# Altium project EMI_TestBoard.PrjPcb
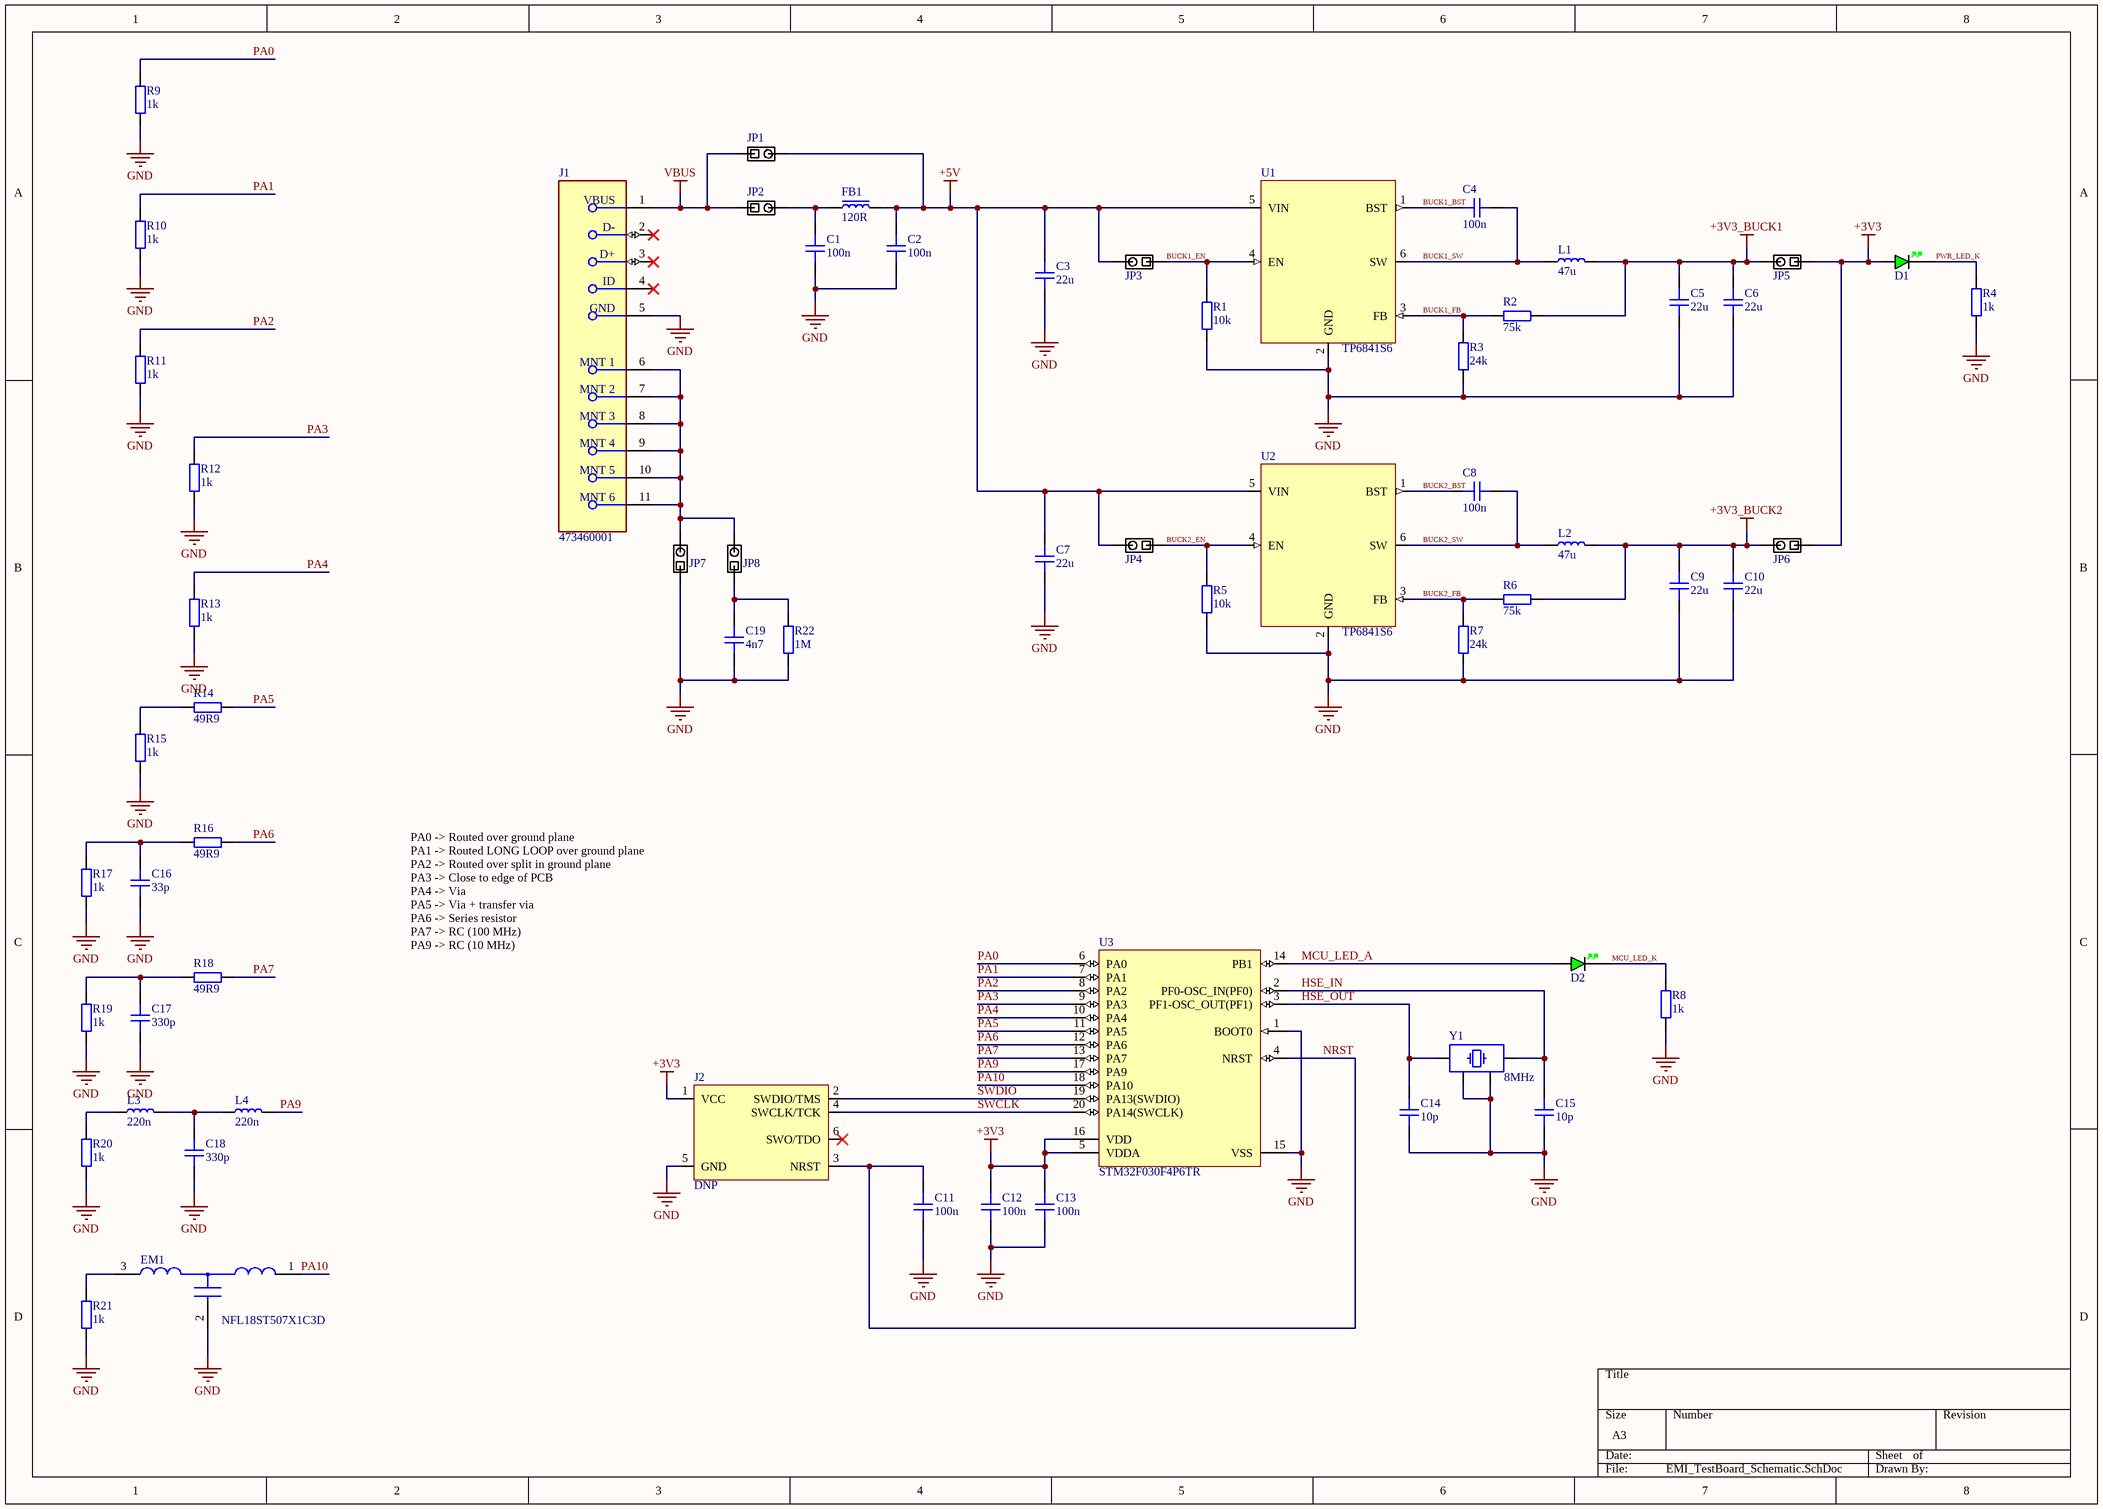
[diagram p0: EMI_TestBoard_Schematic.SchDoc]
1 sheet, 63 parts. Net scope: global (net labels, ports and power ports of the same name join across sheets).
Board file: EMI_TestBoard_PCB.PcbDoc

## Sheet EMI_TestBoard_Schematic.SchDoc
size A3; SheetNumber: 1; SheetTotal: 1

### Parts
C1  100n  [CAP_0603]
C2  100n  [CAP_0603]
C3  22u  [CAP_1210]
C4  100n  [CAP_0603]
C5  22u  [CAP_1210]
C6  22u  [CAP_1210]
C7  22u  [CAP_1210]
C8  100n  [CAP_0603]
C9  22u  [CAP_1210]
C10  22u  [CAP_1210]
C11  100n  [CAP_0603]
C12  100n  [CAP_0603]
C13  100n  [CAP_0603]
C14  10p  [CAP_0603]
C15  10p  [CAP_0603]
C16  33p  [CAP_0603]
C17  330p  [CAP_0603]
C18  330p  [CAP_0603]
C19  4n7  [CAP_0603]
D1  GREEN  [LED_0402_GREEN]  (value not drawn)
D2  GREEN  [LED_0402_GREEN]  (value not drawn)
EM1  NFL18ST507X1C3D  [FP-NFL18ST-MFG]
FB1  120R  [FB_0603]
J1  473460001  [FP-473460001-MFG]
J2  DNP  [TC2030-NL-FP]
JP1  Solder Jumper  [SolderJumper_Single]  (value not drawn)
JP2  Solder Jumper  [SolderJumper_Single]  (value not drawn)
JP3  Solder Jumper  [SolderJumper_Single]  (value not drawn)
JP4  Solder Jumper  [SolderJumper_Single]  (value not drawn)
JP5  Solder Jumper  [SolderJumper_Single]  (value not drawn)
JP6  Solder Jumper  [SolderJumper_Single]  (value not drawn)
JP7  Solder Jumper  [SolderJumper_Single]  (value not drawn)
JP8  Solder Jumper  [SolderJumper_Single]  (value not drawn)
L1  47u  [MWSA0603S]
L2  47u  [MWSA0603S]
L3  220n  [IND_0603]
L4  220n  [IND_0603]
R1  10k  [RES_0603]
R2  75k  [RES_0603]
R3  24k  [RES_0603]
R4  1k  [RES_0603]
R5  10k  [RES_0603]
R6  75k  [RES_0603]
R7  24k  [RES_0603]
R8  1k  [RES_0603]
R9  1k  [RES_0603]
R10  1k  [RES_0603]
R11  1k  [RES_0603]
R12  1k  [RES_0603]
R13  1k  [RES_0603]
R14  49R9  [RES_0603]
R15  1k  [RES_0603]
R16  49R9  [RES_0603]
R17  1k  [RES_0603]
R18  49R9  [RES_0603]
R19  1k  [RES_0603]
R20  1k  [RES_0603]
R21  1k  [RES_0603]
R22  1M  [RES_0603]
U1  TP6841S6  [SOT-23-6]
U2  TP6841S6  [SOT-23-6]
U3  STM32F030F4P6TR  [STM-TSSOP20_M]
Y1  8MHz  [XTAL_3225]

### Nets
+3V3: C12.2 C13.2 D1.A J2.1(VCC) JP5.1 JP6.1 U3.5(VDDA) U3.16(VDD)
+3V3_BUCK1: C5.2 C6.2 JP5.2 L1.2 R2.1
+3V3_BUCK2: C9.2 C10.2 JP6.2 L2.2 R6.1
+5V: C2.2 C3.2 C7.2 FB1.2 JP1.2 JP3.2 JP4.2 U1.5(VIN) U2.5(VIN)
GND: C1.1 C2.1 C3.1 C5.1 C6.1 C7.1 C9.1 C10.1 C11.1 C12.1 C13.1 C14.1 C15.1 C16.1 C17.1 C18.1 C19.1 EM1.2(GND) J1.5(GND) J2.5(GND) JP7.1 R1.1 R3.1 R4.1 R5.1 R7.1 R8.1 R9.1 R10.1 R11.1 R12.1 R13.1 R15.1 R17.1 R19.1 R20.1 R21.1 R22.1 U1.2(GND) U2.2(GND) U3.1(BOOT0) U3.15(VSS) Y1.2 Y1.4
VBUS: J1.1(VBUS) JP1.1 JP2.1
BUCK1_BST: C4.2 U1.1(BST)
BUCK1_EN: JP3.1 R1.2 U1.4(EN)
BUCK1_FB: R2.2 R3.2 U1.3(FB)
BUCK1_SW: C4.1 L1.1 U1.6(SW)
BUCK2_BST: C8.2 U2.1(BST)
BUCK2_EN: JP4.1 R5.2 U2.4(EN)
BUCK2_FB: R6.2 R7.2 U2.3(FB)
BUCK2_SW: C8.1 L2.1 U2.6(SW)
HSE_IN: C15.2 U3.2(PF0-OSC_IN(PF0)) Y1.3
HSE_OUT: C14.2 U3.3(PF1-OSC_OUT(PF1)) Y1.1
MCU_LED_A: D2.A U3.14(PB1)
MCU_LED_K: D2.K R8.2
NRST: C11.2 J2.3(NRST) U3.4(NRST)
PA0: R9.2 U3.6(PA0)
PA1: R10.2 U3.7(PA1)
PA2: R11.2 U3.8(PA2)
PA3: R12.2 U3.9(PA3)
PA4: R13.2 U3.10(PA4)
PA5: R14.1 U3.11(PA5)
PA6: R16.1 U3.12(PA6)
PA7: R18.1 U3.13(PA7)
PA9: L4.2 U3.17(PA9)
PA10: EM1.1(Input) U3.18(PA10)
PWR_LED_K: D1.K R4.2
SWCLK: J2.4(SWCLK/TCK) U3.20(PA14(SWCLK))
SWDIO: J2.2(SWDIO/TMS) U3.19(PA13(SWDIO))
NetC1_2: C1.2 FB1.1 JP2.2
NetC16_2: C16.2 R16.2 R17.2
NetC17_2: C17.2 R18.2 R19.2
NetC18_2: C18.2 L3.2 L4.1
NetC19_2: C19.2 JP8.1 R22.2
NetEM1_3: EM1.3(Output) R21.2
NetJ1_6: J1.6(MNT_1) J1.7(MNT_2) J1.8(MNT_3) J1.9(MNT_4) J1.10(MNT_5) J1.11(MNT_6) JP7.2 JP8.2
NetL3_1: L3.1 R20.2
NetR14_2: R14.2 R15.2

Not connected (* = marked no-connect by the designer): J1 2(D-)* 3(D+)* 4(ID)*; J2 6(SWO/TDO)*

### Notes on the sheet
- PA0 -> Routed over ground plane
  PA1 -> Routed LONG LOOP over ground plane
  PA2 -> Routed over split in ground plane
  PA3 -> Close to edge of PCB
  PA4 -> Via
  PA5 -> Via + transfer via
  PA6 -> Series resistor
  PA7 -> RC (100 MHz)
  PA9 -> RC (10 MHz)
  PA10 -> EMI filter (500 MHz)

### Library data of the parts
C1 C2 C4 C8 C11-C19 = CAP_0603_50V: Capacitor SMD 0603 50V
C3 C5-C7 C9 C10 = CAP_1210_10V: Capacitor SMD 1210 10V
D1 D2 = LED_0402_GREEN: LED 0402 GREEN SMD
EM1 = CMP-06051-000283-1: LC combined filters 25pF 110nH 200MHz 16Vdc 150mA 0603; Number of Channels: 1; Voltage Rating (DC): 16V; Circuit Type: Filter; ESD Protection: No; Max Operating Temperature: 125°C; Length: 1.6mm; Packaging: Tape and Reel; Width: 0.031inch; RoHS Compliant: Yes; Termination: Flat; Capacitance: 25pF; Package Quantity: 1; Inductance: 110nH; Max Voltage Rating (DC): 16V; Radiation Hardening: No; Series: EMIFIL®, NFL18ST; Depth: 0.8mm; Mount: Surface Mount; Lead Free: Lead Free; Case Code (Metric): 1608; Current: 150mA; Min Operating Temperature: -55°C; Max Current Rating: 150mA; Case/Package: 0603; Case Code (Imperial): 0603; Current Rating: 150mA; Height: 0.035inch
FB1 = FB_0603: Ferrite Bead SMD 0603
J1 = CMP-2000-05246-2: CONN RCPT USB2.0 MICRO B SMD R/A; Manufacturer: Molex; Conn Orientation: Right Angle; Is Female: yes; Shielding: true; Pitch: 0.65mm; Number Of Contacts: 5; Description: USB - micro B USB 2.0 Receptacle Connector 5 Position Surface Mount, Right Angle; Voltage Rating: 30V; Current Rating: 1.8A; Device Class L2: USB Connectors; Digikey Description: CONN RCPT USB2.0 MICRO B SMD R/A; Height: 2.945mm; RoHS: TRUE; ComponentLink2Description: Datasheet; Octopart: https://octopart.com/47346-0001-molex-7164928; Automotive: No; Package: 0; Category: Conn; Device Class L1: Connectors; Usb Standard: USB 2.0; Temperature: -30°C to +85°C; Temperature Range Low: -30°C; Footprint Url: https://www.molex.com/pdm_docs/sd/473460001_sd.pdf; ComponentLink2URL: https://www.molex.com/webdocs/datasheets/pdf/en-us/0473460001_IO_CONNECTORS.pdf; Lead Free: Yes; Manufacturer Part Number: 473460001; Contact Material: Gold,Nickel; Temperature Range High: +85°C; Device Class L3: unset
J2 = TC2030-NL: Tag-Connect No-Solder SWD Debug Connector (No Legs) DO NOT PLACE; Manufacturer: Tag-Connect; Manfucaturer Number: TC2030-NL-FP
JP1-JP8 = SolderJumper_Single: Solder Jumper Single 0.5mm Pitch
L1 L2 = MWSA0603S: Power Inductor SMD Sunlord MWSA0603S; Manufacturer Part Number: MWSA0603S-; Manufacturer: Sunlord
L3 L4 = IND_0603: Inductor SMD 0603
R1-R22 = RES_0603: Resistor SMD 0603
U1 U2 = TP6841S6: 40V 0.8A 800kHz Synchronous Step-Down Converter; Manufacturer: TECH PUBLIC; Manufacturer Part Number: TP6841S6
U3 = CMP-0304-00066-2: ARM Cortex-M0 32-bit MCU, 16 KB Flash, 4 KB Internal RAM, 15 I/Os, 20-Pin TSSOP, -40 to 85 degC, Tape and Reel; Manufacturer: STMicroelectronics; Supply Voltage(Vcc) min (V): 2.4; I/Os (High Current): 15; Operating Frequency(F) (Processor speed) (MHz): 48; Internal RAM Size (kB): 4; FLASH Size (Prog) (kB): 16; Package Reference: TSSOP20; ComponentLink2URL: http://www.st.com/st-web-ui/static/active/en/resource/technical/document/datasheet/DM00088500.pdf; DatasheetVersion: Rev. 2; ComponentLink1Description: Manufacturer URL; Packing: Tape and Reel; Mounting Technology: Surface Mount; ComponentLink2Description: Datasheet; Core: ARM Cortex-M0; Package Description: 20-Pin Thin Shrink Small Outline Package, Body 6.5 x 4.4 mm, Pitch 0.65 mm; ComponentLink1URL: http://www.st.com/; PartNumber: STM32F030F4P6TR
Y1 = TSX-3225_24.0000MF15X-AC: Crystal SMD 24MHz 10PPM 7pF 3225; Manufacturer: Epson; Manufacturer Number: TSX-3225 24.0000MF15X-AC; ESR: 40R; Value: 24MHz; Type: XTAL; Load Capacitance: 7pF